# Altium schematic sheet Connections.SchDoc
size A; SheetNumber: 2; SheetTotal: 3
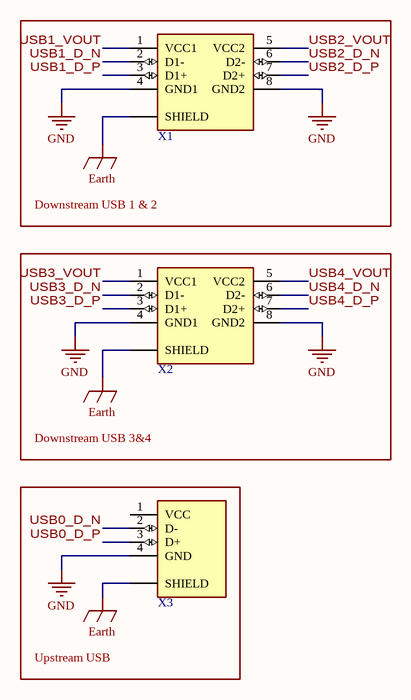
[diagram p0: Connections.SchDoc]

## Parts
X1  USB-A  [[USB] Type-A Dual]  (value not drawn)
X2  USB-A  [[USB] Type-A Dual]  (value not drawn)
X3  USB-B  [[USB] Type-B]  (value not drawn)

## Blocks framed on the sheet
Downstream USB 1 & 2: X1
Downstream USB 3&4: X2
Upstream USB: X3

## Nets
Earth: X1.MH(SHIELD) X2.MH(SHIELD) X3.MH(SHIELD)
GND: X1.4(GND1) X1.8(GND2) X2.4(GND1) X2.8(GND2) X3.4(GND)
USB0_D_N: X3.2(D-)
USB0_D_P: X3.3(D+)
USB1_D_N: X1.2(D1-)
USB1_D_P: X1.3(D1+)
USB1_VOUT: X1.1(VCC1)
USB2_D_N: X1.6(D2-)
USB2_D_P: X1.7(D2+)
USB2_VOUT: X1.5(VCC2)
USB3_D_N: X2.2(D1-)
USB3_D_P: X2.3(D1+)
USB3_VOUT: X2.1(VCC1)
USB4_D_N: X2.6(D2-)
USB4_D_P: X2.7(D2+)
USB4_VOUT: X2.5(VCC2)

Not connected (* = marked no-connect by the designer): X3 1(VCC)

## Library data of the parts
X1 X2 = [USB] Type-A Dual: 61400826021; Supplier 1: DigiKey; Supplier Part Number 1: 732-2107-ND
X3 = [USB] Type-B: USB-B-S-F-B-TH; Supplier 1: DigiKey; Supplier Part Number 1: SAM10867-ND